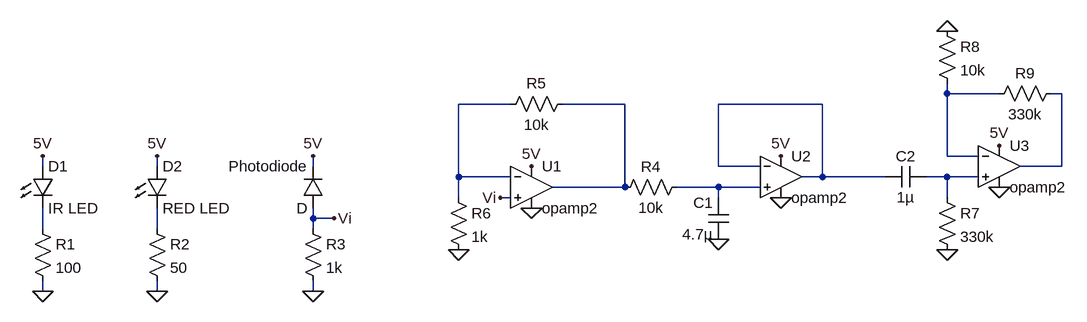
[diagram p0: schematic ppg circuit.asc]
ppg circuit.asc, the LTspice schematic file:
Version 4
SHEET 1 1680 680
WIRE 1456 -80 1456 -96
WIRE 1536 -80 1456 -80
WIRE 1632 -80 1616 -80
WIRE 784 -64 704 -64
WIRE 960 -64 864 -64
WIRE 1264 -64 1104 -64
WIRE 1456 16 1456 -80
WIRE 1504 16 1456 16
WIRE 64 32 64 16
WIRE 240 32 240 16
WIRE 480 32 480 16
WIRE 1104 32 1104 -64
WIRE 1168 32 1104 32
WIRE 1632 32 1632 -80
WIRE 1632 32 1568 32
WIRE 704 48 704 -64
WIRE 784 48 704 48
WIRE 1264 48 1264 -64
WIRE 1264 48 1232 48
WIRE 1360 48 1264 48
WIRE 1456 48 1424 48
WIRE 1504 48 1456 48
WIRE 960 64 960 -64
WIRE 960 64 848 64
WIRE 1104 64 1040 64
WIRE 1168 64 1104 64
WIRE 704 80 704 48
WIRE 784 80 768 80
WIRE 1104 80 1104 64
WIRE 1456 80 1456 48
WIRE 480 112 480 96
WIRE 512 112 480 112
WIRE 64 128 64 96
WIRE 240 128 240 96
WIRE 480 128 480 112
WIRE 64 224 64 208
WIRE 240 224 240 208
WIRE 480 224 480 208
FLAG 64 224 0
FLAG 64 16 5V
FLAG 240 224 0
FLAG 240 16 5V
FLAG 480 224 0
FLAG 480 16 5V
FLAG 512 112 Vi
FLAG 816 32 5V
FLAG 816 96 0
FLAG 768 80 Vi
FLAG 704 160 0
FLAG 1104 144 0
FLAG 1200 16 5V
FLAG 1200 80 0
FLAG 1536 0 5V
FLAG 1536 64 0
FLAG 1456 160 0
FLAG 1456 -176 0
SYMBOL res 48 112 R0
SYMATTR InstName R1
SYMATTR Value 100
SYMBOL LED 48 32 R0
SYMATTR InstName D1
SYMATTR Value IR LED
SYMBOL res 224 112 R0
SYMATTR InstName R2
SYMATTR Value 50
SYMBOL LED 224 32 R0
SYMATTR InstName D2
SYMATTR Value RED LED
SYMBOL diode 496 96 R180
WINDOW 0 24 64 Left 2
WINDOW 3 24 0 Left 2
SYMATTR InstName Photodiode
SYMBOL res 464 112 R0
SYMATTR InstName R3
SYMATTR Value 1k
SYMBOL Opamps\\opamp2 816 0 R0
SYMATTR InstName U1
SYMBOL res 944 80 R270
WINDOW 0 32 56 VTop 2
WINDOW 3 0 56 VBottom 2
SYMATTR InstName R4
SYMATTR Value 10k
SYMBOL res 880 -80 R90
WINDOW 0 0 56 VBottom 2
WINDOW 3 32 56 VTop 2
SYMATTR InstName R5
SYMATTR Value 10k
SYMBOL res 688 64 R0
SYMATTR InstName R6
SYMATTR Value 1k
SYMBOL cap 1120 144 R180
WINDOW 0 24 56 Left 2
WINDOW 3 24 8 Left 2
SYMATTR InstName C1
SYMATTR Value 4.7µ
SYMBOL Opamps\\opamp2 1200 -16 R0
SYMATTR InstName U2
SYMBOL cap 1360 64 R270
WINDOW 0 32 32 VTop 2
WINDOW 3 0 32 VBottom 2
SYMATTR InstName C2
SYMATTR Value 1µ
SYMBOL Opamps\\opamp2 1536 -32 R0
SYMATTR InstName U3
SYMBOL res 1440 64 R0
SYMATTR InstName R7
SYMATTR Value 330k
SYMBOL res 1440 -192 R0
SYMATTR InstName R8
SYMATTR Value 10k
SYMBOL res 1632 -96 R90
WINDOW 0 0 56 VBottom 2
WINDOW 3 32 56 VTop 2
SYMATTR InstName R9
SYMATTR Value 330k

The netlist it stands for:
* ppg circuit.asc
R1 N008 0 100
D1 5V N008 IR LED
R2 N009 0 50
D2 5V N009 RED LED
D§Photodiode Vi 5V D
R3 Vi 0 1k
XU1 Vi N003 5V 0 N004 opamp2  ; pins In+ In- V+ V- OUT
R4 N004 N007 10k
R5 N004 N003 10k
R6 N003 0 1k
C1 0 N007 4.7µ
XU2 N007 N005 5V 0 N005 opamp2  ; pins In+ In- V+ V- OUT
C2 N005 N006 1µ
XU3 N006 N001 5V 0 N002 opamp2  ; pins In+ In- V+ V- OUT
R7 N006 0 330k
R8 0 N001 10k
R9 N002 N001 330k
.model D D
.lib standard.dio
.backanno
.end